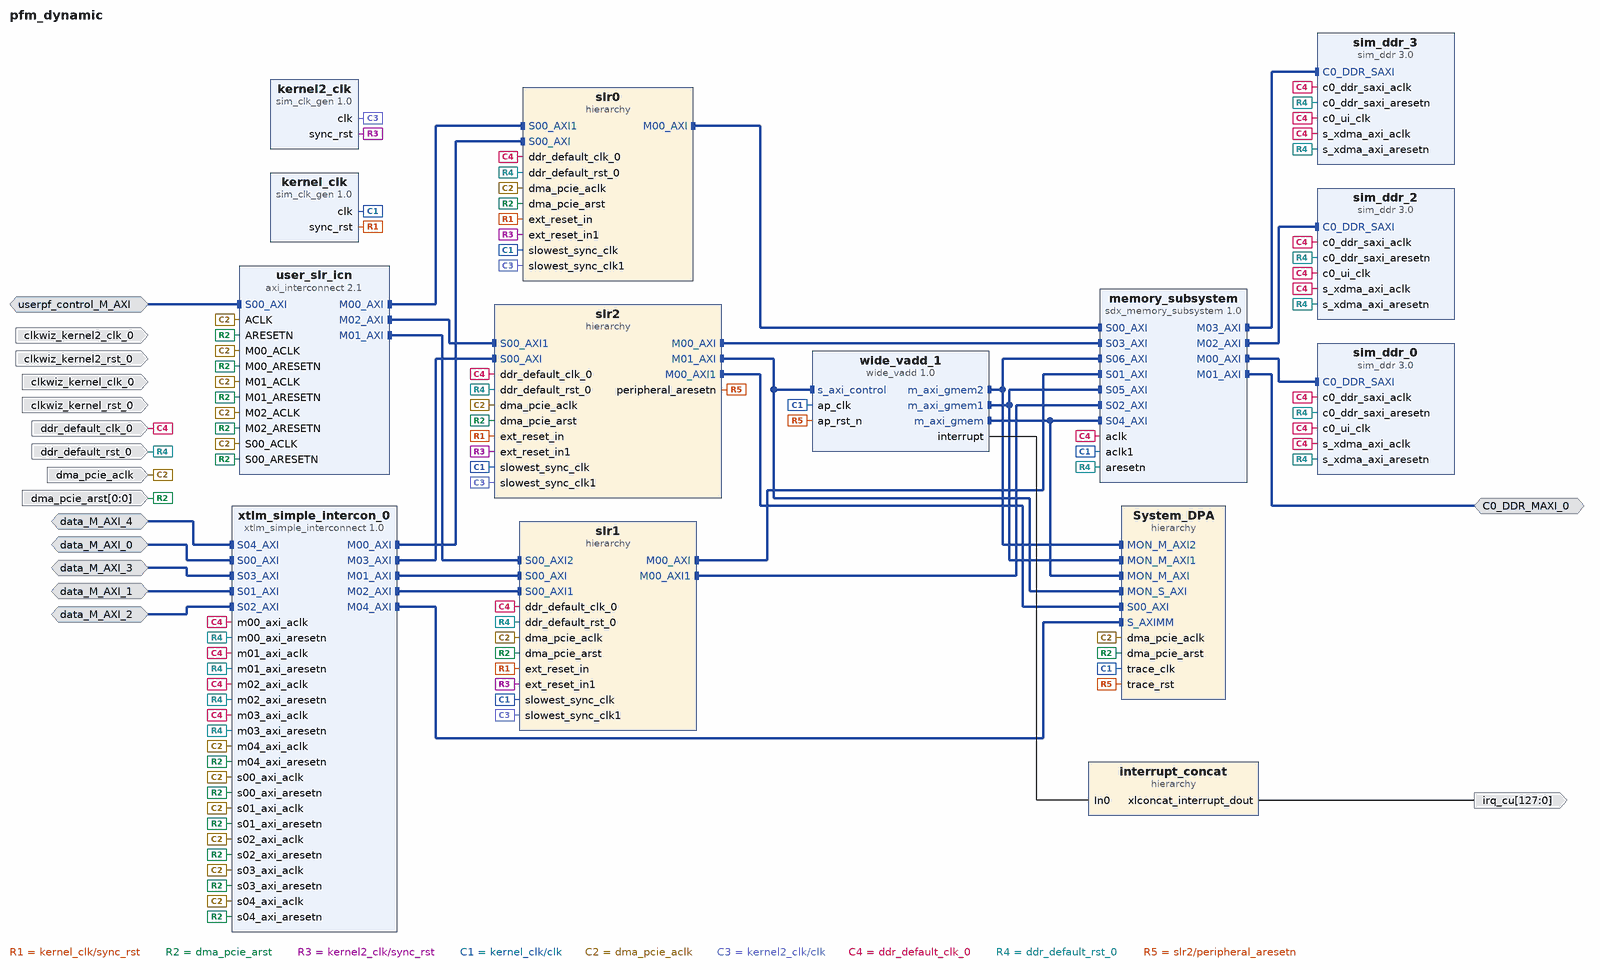
[diagram p0: block diagram of the top level]
# Vivado block design pfm_dynamic, xcvu9p-flgb2104-2-i, Vivado 2020.1
create_bd_design pfm_dynamic

create_bd_intf_port -mode Master -vlnv xilinx.com:interface:aximm_rtl:1.0 C0_DDR_MAXI_0
set_property -dict [list \
  CONFIG.DATA_WIDTH 512 \
  CONFIG.PROTOCOL AXI4 \
  CONFIG.FREQ_HZ 300120048 \
  CONFIG.ADDR_WIDTH 35 \
  CONFIG.HAS_BURST 1 \
  CONFIG.HAS_LOCK 0 \
  CONFIG.HAS_PROT 1 \
  CONFIG.HAS_CACHE 0 \
  CONFIG.HAS_QOS 0 \
  CONFIG.HAS_REGION 0 \
  CONFIG.HAS_WSTRB 1 \
  CONFIG.HAS_BRESP 1 \
  CONFIG.HAS_RRESP 1 \
] [get_bd_intf_ports C0_DDR_MAXI_0]
create_bd_intf_port -mode Slave -vlnv xilinx.com:interface:aximm_rtl:1.0 data_M_AXI_0
set_property -dict [list \
  CONFIG.DATA_WIDTH 32 \
  CONFIG.PROTOCOL AXI4 \
  CONFIG.FREQ_HZ 300000000 \
  CONFIG.ID_WIDTH 1 \
  CONFIG.ADDR_WIDTH 64 \
  CONFIG.AWUSER_WIDTH 0 \
  CONFIG.ARUSER_WIDTH 0 \
  CONFIG.WUSER_WIDTH 0 \
  CONFIG.RUSER_WIDTH 0 \
  CONFIG.BUSER_WIDTH 0 \
  CONFIG.READ_WRITE_MODE READ_WRITE \
  CONFIG.HAS_BURST 1 \
  CONFIG.HAS_LOCK 0 \
  CONFIG.HAS_PROT 1 \
  CONFIG.HAS_CACHE 0 \
  CONFIG.HAS_QOS 0 \
  CONFIG.HAS_REGION 0 \
  CONFIG.HAS_WSTRB 1 \
  CONFIG.HAS_BRESP 1 \
  CONFIG.HAS_RRESP 1 \
  CONFIG.SUPPORTS_NARROW_BURST 1 \
  CONFIG.NUM_READ_OUTSTANDING 2 \
  CONFIG.NUM_WRITE_OUTSTANDING 2 \
  CONFIG.MAX_BURST_LENGTH 1 \
  CONFIG.NUM_READ_THREADS 1 \
  CONFIG.NUM_WRITE_THREADS 1 \
  CONFIG.RUSER_BITS_PER_BYTE 0 \
  CONFIG.WUSER_BITS_PER_BYTE 0 \
] [get_bd_intf_ports data_M_AXI_0]
create_bd_intf_port -mode Slave -vlnv xilinx.com:interface:aximm_rtl:1.0 data_M_AXI_1
set_property -dict [list \
  CONFIG.DATA_WIDTH 512 \
  CONFIG.PROTOCOL AXI4 \
  CONFIG.FREQ_HZ 300000000 \
  CONFIG.ID_WIDTH 1 \
  CONFIG.ADDR_WIDTH 64 \
  CONFIG.AWUSER_WIDTH 0 \
  CONFIG.ARUSER_WIDTH 0 \
  CONFIG.WUSER_WIDTH 0 \
  CONFIG.RUSER_WIDTH 0 \
  CONFIG.BUSER_WIDTH 0 \
  CONFIG.READ_WRITE_MODE READ_WRITE \
  CONFIG.HAS_BURST 1 \
  CONFIG.HAS_LOCK 0 \
  CONFIG.HAS_PROT 1 \
  CONFIG.HAS_CACHE 0 \
  CONFIG.HAS_QOS 0 \
  CONFIG.HAS_REGION 0 \
  CONFIG.HAS_WSTRB 1 \
  CONFIG.HAS_BRESP 1 \
  CONFIG.HAS_RRESP 1 \
  CONFIG.SUPPORTS_NARROW_BURST 1 \
  CONFIG.NUM_READ_OUTSTANDING 2 \
  CONFIG.NUM_WRITE_OUTSTANDING 2 \
  CONFIG.MAX_BURST_LENGTH 1 \
  CONFIG.NUM_READ_THREADS 1 \
  CONFIG.NUM_WRITE_THREADS 1 \
  CONFIG.RUSER_BITS_PER_BYTE 0 \
  CONFIG.WUSER_BITS_PER_BYTE 0 \
] [get_bd_intf_ports data_M_AXI_1]
create_bd_intf_port -mode Slave -vlnv xilinx.com:interface:aximm_rtl:1.0 data_M_AXI_2
set_property -dict [list \
  CONFIG.DATA_WIDTH 512 \
  CONFIG.PROTOCOL AXI4 \
  CONFIG.FREQ_HZ 300000000 \
  CONFIG.ID_WIDTH 1 \
  CONFIG.ADDR_WIDTH 64 \
  CONFIG.AWUSER_WIDTH 0 \
  CONFIG.ARUSER_WIDTH 0 \
  CONFIG.WUSER_WIDTH 0 \
  CONFIG.RUSER_WIDTH 0 \
  CONFIG.BUSER_WIDTH 0 \
  CONFIG.READ_WRITE_MODE READ_WRITE \
  CONFIG.HAS_BURST 1 \
  CONFIG.HAS_LOCK 0 \
  CONFIG.HAS_PROT 1 \
  CONFIG.HAS_CACHE 0 \
  CONFIG.HAS_QOS 0 \
  CONFIG.HAS_REGION 0 \
  CONFIG.HAS_WSTRB 1 \
  CONFIG.HAS_BRESP 1 \
  CONFIG.HAS_RRESP 1 \
  CONFIG.SUPPORTS_NARROW_BURST 1 \
  CONFIG.NUM_READ_OUTSTANDING 2 \
  CONFIG.NUM_WRITE_OUTSTANDING 2 \
  CONFIG.MAX_BURST_LENGTH 1 \
  CONFIG.NUM_READ_THREADS 1 \
  CONFIG.NUM_WRITE_THREADS 1 \
  CONFIG.RUSER_BITS_PER_BYTE 0 \
  CONFIG.WUSER_BITS_PER_BYTE 0 \
] [get_bd_intf_ports data_M_AXI_2]
create_bd_intf_port -mode Slave -vlnv xilinx.com:interface:aximm_rtl:1.0 data_M_AXI_3
set_property -dict [list \
  CONFIG.DATA_WIDTH 512 \
  CONFIG.PROTOCOL AXI4 \
  CONFIG.FREQ_HZ 300000000 \
  CONFIG.ID_WIDTH 1 \
  CONFIG.ADDR_WIDTH 64 \
  CONFIG.AWUSER_WIDTH 0 \
  CONFIG.ARUSER_WIDTH 0 \
  CONFIG.WUSER_WIDTH 0 \
  CONFIG.RUSER_WIDTH 0 \
  CONFIG.BUSER_WIDTH 0 \
  CONFIG.READ_WRITE_MODE READ_WRITE \
  CONFIG.HAS_BURST 1 \
  CONFIG.HAS_LOCK 0 \
  CONFIG.HAS_PROT 1 \
  CONFIG.HAS_CACHE 0 \
  CONFIG.HAS_QOS 0 \
  CONFIG.HAS_REGION 0 \
  CONFIG.HAS_WSTRB 1 \
  CONFIG.HAS_BRESP 1 \
  CONFIG.HAS_RRESP 1 \
  CONFIG.SUPPORTS_NARROW_BURST 1 \
  CONFIG.NUM_READ_OUTSTANDING 2 \
  CONFIG.NUM_WRITE_OUTSTANDING 2 \
  CONFIG.MAX_BURST_LENGTH 1 \
  CONFIG.NUM_READ_THREADS 1 \
  CONFIG.NUM_WRITE_THREADS 1 \
  CONFIG.RUSER_BITS_PER_BYTE 0 \
  CONFIG.WUSER_BITS_PER_BYTE 0 \
] [get_bd_intf_ports data_M_AXI_3]
create_bd_intf_port -mode Slave -vlnv xilinx.com:interface:aximm_rtl:1.0 data_M_AXI_4
set_property -dict [list \
  CONFIG.DATA_WIDTH 512 \
  CONFIG.PROTOCOL AXI4 \
  CONFIG.FREQ_HZ 300000000 \
  CONFIG.ID_WIDTH 1 \
  CONFIG.ADDR_WIDTH 64 \
  CONFIG.AWUSER_WIDTH 0 \
  CONFIG.ARUSER_WIDTH 0 \
  CONFIG.WUSER_WIDTH 0 \
  CONFIG.RUSER_WIDTH 0 \
  CONFIG.BUSER_WIDTH 0 \
  CONFIG.READ_WRITE_MODE READ_WRITE \
  CONFIG.HAS_BURST 1 \
  CONFIG.HAS_LOCK 0 \
  CONFIG.HAS_PROT 1 \
  CONFIG.HAS_CACHE 0 \
  CONFIG.HAS_QOS 0 \
  CONFIG.HAS_REGION 0 \
  CONFIG.HAS_WSTRB 1 \
  CONFIG.HAS_BRESP 1 \
  CONFIG.HAS_RRESP 1 \
  CONFIG.SUPPORTS_NARROW_BURST 1 \
  CONFIG.NUM_READ_OUTSTANDING 2 \
  CONFIG.NUM_WRITE_OUTSTANDING 2 \
  CONFIG.MAX_BURST_LENGTH 1 \
  CONFIG.NUM_READ_THREADS 1 \
  CONFIG.NUM_WRITE_THREADS 1 \
  CONFIG.RUSER_BITS_PER_BYTE 0 \
  CONFIG.WUSER_BITS_PER_BYTE 0 \
] [get_bd_intf_ports data_M_AXI_4]
create_bd_intf_port -mode Slave -vlnv xilinx.com:interface:aximm_rtl:1.0 userpf_control_M_AXI
set_property -dict [list \
  CONFIG.DATA_WIDTH 32 \
  CONFIG.PROTOCOL AXI4LITE \
  CONFIG.FREQ_HZ 300000000 \
  CONFIG.ID_WIDTH 0 \
  CONFIG.ADDR_WIDTH 29 \
  CONFIG.AWUSER_WIDTH 0 \
  CONFIG.ARUSER_WIDTH 0 \
  CONFIG.WUSER_WIDTH 0 \
  CONFIG.RUSER_WIDTH 0 \
  CONFIG.BUSER_WIDTH 0 \
  CONFIG.READ_WRITE_MODE READ_WRITE \
  CONFIG.HAS_BURST 0 \
  CONFIG.HAS_LOCK 0 \
  CONFIG.HAS_PROT 1 \
  CONFIG.HAS_CACHE 0 \
  CONFIG.HAS_QOS 0 \
  CONFIG.HAS_REGION 0 \
  CONFIG.HAS_WSTRB 1 \
  CONFIG.HAS_BRESP 1 \
  CONFIG.HAS_RRESP 1 \
  CONFIG.SUPPORTS_NARROW_BURST 0 \
  CONFIG.NUM_READ_OUTSTANDING 2 \
  CONFIG.NUM_WRITE_OUTSTANDING 2 \
  CONFIG.MAX_BURST_LENGTH 1 \
  CONFIG.NUM_READ_THREADS 1 \
  CONFIG.NUM_WRITE_THREADS 1 \
  CONFIG.RUSER_BITS_PER_BYTE 0 \
  CONFIG.WUSER_BITS_PER_BYTE 0 \
] [get_bd_intf_ports userpf_control_M_AXI]
create_bd_port -dir I -type clk clkwiz_kernel2_clk_0
set_property -dict {CONFIG.FREQ_HZ 500000000} [get_bd_ports clkwiz_kernel2_clk_0]
create_bd_port -dir I -type clk clkwiz_kernel_clk_0
set_property -dict {CONFIG.FREQ_HZ 300000000} [get_bd_ports clkwiz_kernel_clk_0]
create_bd_port -dir I -type rst clkwiz_kernel2_rst_0
create_bd_port -dir I -type rst clkwiz_kernel_rst_0
create_bd_port -dir I -type clk dma_pcie_aclk
set_property -dict [list \
  CONFIG.ASSOCIATED_BUSIF userpf_control_M_AXI:userpf_control_M_AXI_slr1:userpf_control_M_AXI_slr2:data_M_AXI_0:data_M_AXI_1:data_M_AXI_2:data_M_AXI_3:data_M_AXI_4 \
  CONFIG.FREQ_HZ 300000000 \
] [get_bd_ports dma_pcie_aclk]
create_bd_port -dir O -from 127 -to 0 -type intr irq_cu
create_bd_port -dir I -from 0 -to 0 -type rst dma_pcie_arst
create_bd_port -dir I -type clk ddr_default_clk_0
set_property -dict {CONFIG.ASSOCIATED_BUSIF C0_DDR_MAXI_0 CONFIG.FREQ_HZ 300120048} [get_bd_ports ddr_default_clk_0]
create_bd_port -dir I -type rst ddr_default_rst_0

create_bd_cell -type ip -vlnv xilinx.com:ip:sim_clk_gen:1.0 kernel2_clk
set_property -dict {CONFIG.FREQ_HZ 500000000} [get_bd_cells kernel2_clk]
create_bd_cell -type ip -vlnv xilinx.com:ip:sim_clk_gen:1.0 kernel_clk
set_property -dict {CONFIG.FREQ_HZ 300000000} [get_bd_cells kernel_clk]
create_bd_cell -type ip -vlnv xilinx.com:ip:xtlm_simple_interconnect:1.0 xtlm_simple_intercon_0
set_property -dict [list \
  CONFIG.C_ADDR_RANGES 2 \
  CONFIG.C_M00_A00_ADDR_RANGE {"0000000000000000000000000000001111111111111111111111111111111111"} \
  CONFIG.C_M00_A00_BASE_ADDRESS 0x0000004000000000 \
  CONFIG.C_M00_A01_ADDR_RANGE 0x0000000000060000 \
  CONFIG.C_M00_A01_BASE_ADDRESS {"0000000000000000000000000101000000000000000000000000000000000000"} \
  CONFIG.C_M00_AXI_ADDR_WIDTH 64 \
  CONFIG.C_M00_AXI_DATA_WIDTH 32 \
  CONFIG.C_M01_A00_ADDR_RANGE {"0000000000000000000000000000001111111111111111111111111111111111"} \
  CONFIG.C_M01_A00_BASE_ADDRESS 0x0000000400000000 \
  CONFIG.C_M01_A01_ADDR_RANGE 0x0000000000060000 \
  CONFIG.C_M01_A01_BASE_ADDRESS {"0000000000000000000000000101000000000000000000000000000000000000"} \
  CONFIG.C_M01_AXI_ADDR_WIDTH 64 \
  CONFIG.C_M01_AXI_DATA_WIDTH 32 \
  CONFIG.C_M02_A00_ADDR_RANGE {"0000000000000000000000000000001111111111111111111111111111111111"} \
  CONFIG.C_M02_A00_BASE_ADDRESS 0x0000004800000000 \
  CONFIG.C_M02_A01_ADDR_RANGE 0x0000000000060000 \
  CONFIG.C_M02_A01_BASE_ADDRESS {"0000000000000000000000000101000000000000000000000000000000000000"} \
  CONFIG.C_M02_AXI_ADDR_WIDTH 64 \
  CONFIG.C_M02_AXI_DATA_WIDTH 32 \
  CONFIG.C_M03_A00_ADDR_RANGE {"0000000000000000000000000000001111111111111111111111111111111111"} \
  CONFIG.C_M03_A00_BASE_ADDRESS 0x0000004C00000000 \
  CONFIG.C_M03_A01_ADDR_RANGE 0x0000000000060000 \
  CONFIG.C_M03_A01_BASE_ADDRESS {"0000000000000000000000000101000000000000000000000000000000000000"} \
  CONFIG.C_M03_AXI_ADDR_WIDTH 64 \
  CONFIG.C_M03_AXI_DATA_WIDTH 32 \
  CONFIG.C_M04_A00_ADDR_RANGE 0x0000000200000000 \
  CONFIG.C_M04_A00_BASE_ADDRESS 0x0000000000000000 \
  CONFIG.C_M04_AXI_DATA_WIDTH 64 \
  CONFIG.C_NUM_MI 5 \
  CONFIG.C_NUM_SI 5 \
  CONFIG.C_S00_AXI_ADDR_WIDTH 64 \
  CONFIG.C_S00_AXI_DATA_WIDTH 32 \
  CONFIG.C_S01_AXI_ADDR_WIDTH 64 \
  CONFIG.C_S01_AXI_DATA_WIDTH 512 \
  CONFIG.C_S02_AXI_ADDR_WIDTH 64 \
  CONFIG.C_S02_AXI_DATA_WIDTH 512 \
  CONFIG.C_S03_AXI_ADDR_WIDTH 64 \
  CONFIG.C_S03_AXI_DATA_WIDTH 512 \
  CONFIG.C_S04_AXI_ADDR_WIDTH 64 \
  CONFIG.C_S04_AXI_DATA_WIDTH 512 \
] [get_bd_cells xtlm_simple_intercon_0]
create_bd_cell -type hier interrupt_concat
create_bd_cell -type ip -vlnv xilinx.com:ip:sdx_memory_subsystem:1.0 memory_subsystem
set_property -dict [list \
  CONFIG.ADVANCED_PROPERTIES {resource_map_replication {S00_AXI {} S01_AXI {} S02_AXI {} S03_AXI {}} plram_specifications {{ SIZE 128K AXI_DATA_WIDTH 512 SLR_ASSIGNMENT SLR2 } { SIZE 128K AXI_DATA_WIDTH 512 SLR_ASSIGNMENT SLR1 } { SIZE 128K AXI_DATA_WIDTH 512 SLR_ASSIGNMENT SLR0 }} resource_access_constraints {S00_AXI {M00_AXI_MEM00 PLRAM_MEM00 PLRAM_MEM01 PLRAM_MEM02} S01_AXI M01_AXI_MEM00 S02_AXI M02_AXI_MEM00 S03_AXI M03_AXI_MEM00} __temp_dsa_info {excluded_board_components {amazon:minotaur-vu9p-f1:ddr4_sdram_c0:1.0 amazon:minotaur-vu9p-f1:ddr4_sdram_c1:1.0 amazon:minotaur-vu9p-f1:ddr4_sdram_c2:1.0 amazon:minotaur-vu9p-f1:ddr4_sdram_c3:1.0} axi_passthrough {amazon:minotaur-vu9p-f1:ddr4_sdram_c0:1.0 {offset 0x4000000000 range 16G slr SLR0} amazon:minotaur-vu9p-f1:ddr4_sdram_c1:1.0 {offset 0x400000000 range 16G slr SLR1} amazon:minotaur-vu9p-f1:ddr4_sdram_c2:1.0 {offset 0x4800000000 range 16G slr SLR1} amazon:minotaur-vu9p-f1:ddr4_sdram_c3:1.0 {offset 0x4c00000000 range 16G slr SLR2}} sim_props {ddr4_0 {offset 0x4000000000 range 0x400000000 slr SLR0 passthrough yes} ddr4_1 {offset 0x400000000 range 0x400000000 slr SLR1 passthrough yes} ddr4_2 {offset 0x4800000000 range 0x400000000 slr SLR1 passthrough yes} ddr4_3 {offset 0x4c00000000 range 0x400000000 slr SLR2 passthrough yes} plram_0 {offset 0x5000000000 range 0x20000 slr SLR0 passthrough no} plram_1 {offset 0x5000020000 range 0x20000 slr SLR1 passthrough no} plram_2 {offset 0x5000040000 range 0x20000 slr SLR2 passthrough no}} slr_pblock_map {SLR0 block_dynamic_SLR0 SLR1 pblock_dynamic_SLR1 SLR2 pblock_dynamic_SLR2} child_pblock_declarations {pblock_ddr4_mem00 {range CLOCKREGION_X2Y1:CLOCKREGION_X2Y3 parent pblock_dynamic_SLR0 cell_paths memory/ddr4_mem00} pblock_ddr4_mem02 {range CLOCKREGION_X2Y7:CLOCKREGION_X2Y9 parent pblock_dynamic_SLR1 cell_paths memory/ddr4_mem02} pblock_ddr4_mem03 {range CLOCKREGION_X4Y11:CLOCKREGION_X4Y13 parent pblock_dynamic_SLR2 cell_paths memory/ddr4_mem03}} board_component_slr_map {aws_ddra SLR2 aws_ddrb SLR1 aws_ddrc SLR1 aws_ddrd SLR0}}} \
  CONFIG.NUM_CLKS 2 \
  CONFIG.NUM_SI 7 \
] [get_bd_cells memory_subsystem]
create_bd_cell -type ip -vlnv xilinx.com:user:sim_ddr:3.0 sim_ddr_0
set_property -dict [list \
  CONFIG.C0_A00_BASE_ADDR 0x0 \
  CONFIG.C0_A00_HIGH_ADDR 0x0000000400000000 \
  CONFIG.C0_APP_ADDR_WIDTH 31 \
  CONFIG.C0_APP_DATA_WIDTH 512 \
  CONFIG.C0_BANK_GROUP_WIDTH 2 \
  CONFIG.C0_BANK_WIDTH 2 \
  CONFIG.C0_COLUMN_WIDTH 10 \
  CONFIG.C0_DATA_WIDTH 72 \
  CONFIG.C0_DDR_SAXI_ADDR_WIDTH 34 \
  CONFIG.C0_DDR_SAXI_BASEADDR 0x0000000000000000 \
  CONFIG.C0_DDR_SAXI_DATA_WIDTH 512 \
  CONFIG.C0_DDR_SAXI_HIGHADDR 0x0000000400000000 \
  CONFIG.C0_MEMORY_PART MTA18ASF2G72PZ-2G3 \
  CONFIG.C0_MEM_ADDR_MAP ROW_COLUMN_BANK \
  CONFIG.C0_Mem_Add_Map ROW_COLUMN_BANK \
  CONFIG.C0_RANK_WIDTH 1 \
  CONFIG.C0_ROW_WIDTH 17 \
  CONFIG.C0_SIZE 16GB \
  CONFIG.C0_TIMEPERIOD_PS 833 \
  CONFIG.C0_TYPE ddr4 \
  CONFIG.C0_tCK 833 \
  CONFIG.C0_tCKE 0 \
  CONFIG.C0_tFAW 16 \
  CONFIG.C0_tMRD 2 \
  CONFIG.C0_tRAS 39 \
  CONFIG.C0_tRCD 17 \
  CONFIG.C0_tREFI 9363 \
  CONFIG.C0_tRFC 421 \
  CONFIG.C0_tRP 17 \
  CONFIG.C0_tRRD_L 6 \
  CONFIG.C0_tRRD_S 4 \
  CONFIG.C0_tRTP 10 \
  CONFIG.C0_tWR 19 \
  CONFIG.C0_tWTR_L 10 \
  CONFIG.C0_tWTR_S 4 \
  CONFIG.C_NUMBER_OF_GLOBAL_MEMORIES 1 \
] [get_bd_cells sim_ddr_0]
create_bd_cell -type ip -vlnv xilinx.com:user:sim_ddr:3.0 sim_ddr_2
set_property -dict [list \
  CONFIG.C0_A00_BASE_ADDR 0x0 \
  CONFIG.C0_A00_HIGH_ADDR 0x0000000400000000 \
  CONFIG.C0_APP_ADDR_WIDTH 31 \
  CONFIG.C0_APP_DATA_WIDTH 512 \
  CONFIG.C0_BANK_GROUP_WIDTH 2 \
  CONFIG.C0_BANK_WIDTH 2 \
  CONFIG.C0_COLUMN_WIDTH 10 \
  CONFIG.C0_DATA_WIDTH 72 \
  CONFIG.C0_DDR_SAXI_ADDR_WIDTH 34 \
  CONFIG.C0_DDR_SAXI_BASEADDR 0x0000000000000000 \
  CONFIG.C0_DDR_SAXI_DATA_WIDTH 512 \
  CONFIG.C0_DDR_SAXI_HIGHADDR 0x0000000400000000 \
  CONFIG.C0_MEMORY_PART MTA18ASF2G72PZ-2G3 \
  CONFIG.C0_MEM_ADDR_MAP ROW_COLUMN_BANK \
  CONFIG.C0_Mem_Add_Map ROW_COLUMN_BANK \
  CONFIG.C0_RANK_WIDTH 1 \
  CONFIG.C0_ROW_WIDTH 17 \
  CONFIG.C0_SIZE 16GB \
  CONFIG.C0_TIMEPERIOD_PS 833 \
  CONFIG.C0_TYPE ddr4 \
  CONFIG.C0_tCK 833 \
  CONFIG.C0_tCKE 0 \
  CONFIG.C0_tFAW 16 \
  CONFIG.C0_tMRD 2 \
  CONFIG.C0_tRAS 39 \
  CONFIG.C0_tRCD 17 \
  CONFIG.C0_tREFI 9363 \
  CONFIG.C0_tRFC 421 \
  CONFIG.C0_tRP 17 \
  CONFIG.C0_tRRD_L 6 \
  CONFIG.C0_tRRD_S 4 \
  CONFIG.C0_tRTP 10 \
  CONFIG.C0_tWR 19 \
  CONFIG.C0_tWTR_L 10 \
  CONFIG.C0_tWTR_S 4 \
  CONFIG.C_NUMBER_OF_GLOBAL_MEMORIES 1 \
] [get_bd_cells sim_ddr_2]
create_bd_cell -type ip -vlnv xilinx.com:user:sim_ddr:3.0 sim_ddr_3
set_property -dict [list \
  CONFIG.C0_A00_BASE_ADDR 0x0 \
  CONFIG.C0_A00_HIGH_ADDR 0x0000000400000000 \
  CONFIG.C0_APP_ADDR_WIDTH 31 \
  CONFIG.C0_APP_DATA_WIDTH 512 \
  CONFIG.C0_BANK_GROUP_WIDTH 2 \
  CONFIG.C0_BANK_WIDTH 2 \
  CONFIG.C0_COLUMN_WIDTH 10 \
  CONFIG.C0_DATA_WIDTH 72 \
  CONFIG.C0_DDR_SAXI_ADDR_WIDTH 34 \
  CONFIG.C0_DDR_SAXI_BASEADDR 0x0000000000000000 \
  CONFIG.C0_DDR_SAXI_DATA_WIDTH 512 \
  CONFIG.C0_DDR_SAXI_HIGHADDR 0x0000000400000000 \
  CONFIG.C0_MEMORY_PART MTA18ASF2G72PZ-2G3 \
  CONFIG.C0_MEM_ADDR_MAP ROW_COLUMN_BANK \
  CONFIG.C0_Mem_Add_Map ROW_COLUMN_BANK \
  CONFIG.C0_RANK_WIDTH 1 \
  CONFIG.C0_ROW_WIDTH 17 \
  CONFIG.C0_SIZE 16GB \
  CONFIG.C0_TIMEPERIOD_PS 833 \
  CONFIG.C0_TYPE ddr4 \
  CONFIG.C0_tCK 833 \
  CONFIG.C0_tCKE 0 \
  CONFIG.C0_tFAW 16 \
  CONFIG.C0_tMRD 2 \
  CONFIG.C0_tRAS 39 \
  CONFIG.C0_tRCD 17 \
  CONFIG.C0_tREFI 9363 \
  CONFIG.C0_tRFC 421 \
  CONFIG.C0_tRP 17 \
  CONFIG.C0_tRRD_L 6 \
  CONFIG.C0_tRRD_S 4 \
  CONFIG.C0_tRTP 10 \
  CONFIG.C0_tWR 19 \
  CONFIG.C0_tWTR_L 10 \
  CONFIG.C0_tWTR_S 4 \
  CONFIG.C_NUMBER_OF_GLOBAL_MEMORIES 1 \
] [get_bd_cells sim_ddr_3]
create_bd_cell -type hier slr0
create_bd_cell -type hier slr1
create_bd_cell -type hier slr2
create_bd_cell -type ip -vlnv xilinx.com:hls:wide_vadd:1.0 wide_vadd_1
set_property -dict {CONFIG.SLR_ASSIGNMENTS SLR2} [get_bd_cells wide_vadd_1]
create_bd_cell -type hier System_DPA
create_bd_cell -type ip -vlnv xilinx.com:ip:axi_interconnect:2.1 user_slr_icn
set_property -dict {CONFIG.NUM_MI 3 CONFIG.NUM_SI 1} [get_bd_cells user_slr_icn]

# ---- hierarchy /interrupt_concat ----
current_bd_instance /interrupt_concat
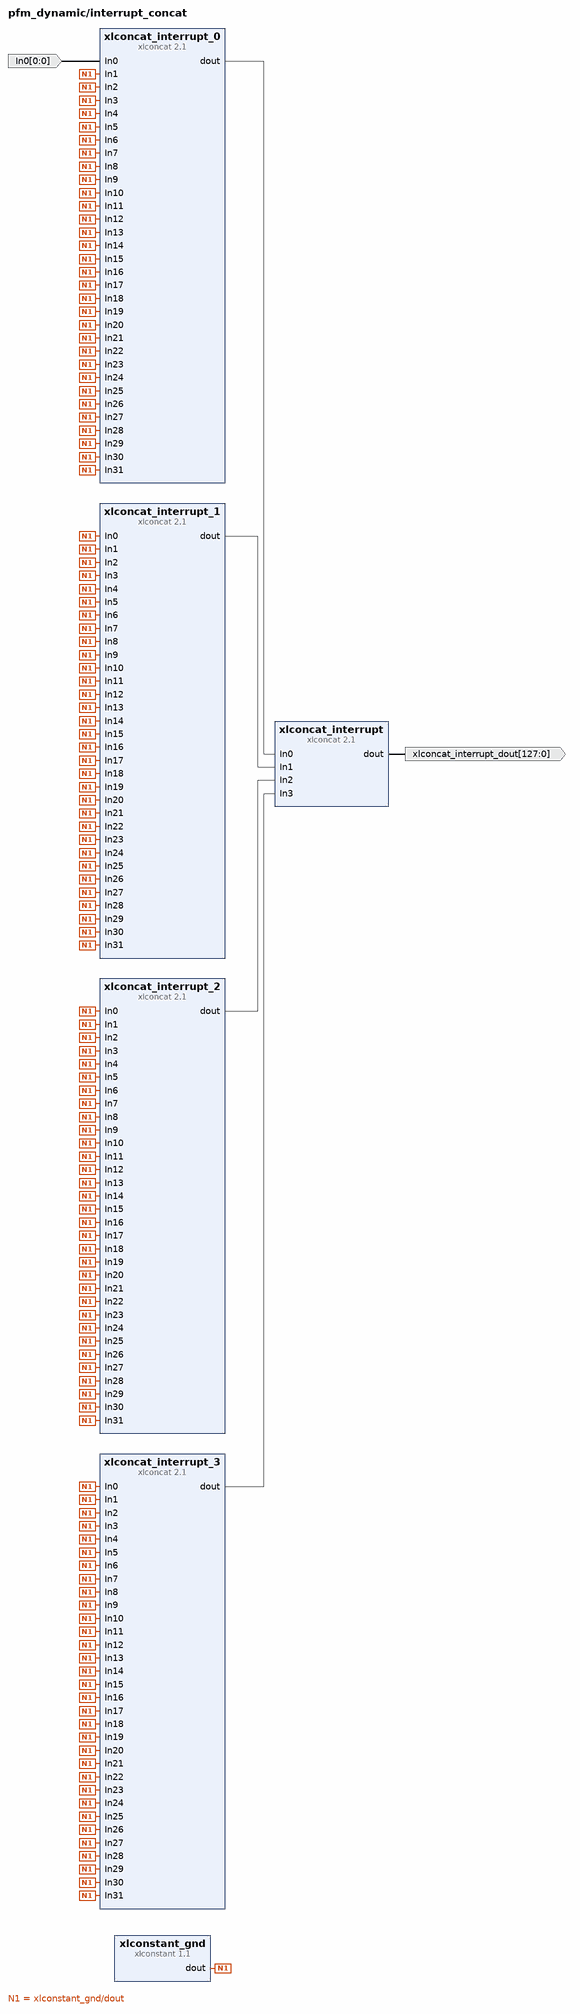
[diagram p1: block diagram inside /interrupt_concat]
create_bd_pin -dir I -from 0 -to 0 In0
create_bd_pin -dir O -from 127 -to 0 xlconcat_interrupt_dout

create_bd_cell -type ip -vlnv xilinx.com:ip:xlconcat:2.1 xlconcat_interrupt
set_property -dict {CONFIG.NUM_PORTS 4} [get_bd_cells xlconcat_interrupt]
create_bd_cell -type ip -vlnv xilinx.com:ip:xlconcat:2.1 xlconcat_interrupt_0
set_property -dict {CONFIG.NUM_PORTS 32} [get_bd_cells xlconcat_interrupt_0]
create_bd_cell -type ip -vlnv xilinx.com:ip:xlconcat:2.1 xlconcat_interrupt_1
set_property -dict {CONFIG.NUM_PORTS 32} [get_bd_cells xlconcat_interrupt_1]
create_bd_cell -type ip -vlnv xilinx.com:ip:xlconcat:2.1 xlconcat_interrupt_2
set_property -dict {CONFIG.NUM_PORTS 32} [get_bd_cells xlconcat_interrupt_2]
create_bd_cell -type ip -vlnv xilinx.com:ip:xlconcat:2.1 xlconcat_interrupt_3
set_property -dict {CONFIG.NUM_PORTS 32} [get_bd_cells xlconcat_interrupt_3]
create_bd_cell -type ip -vlnv xilinx.com:ip:xlconstant:1.1 xlconstant_gnd
set_property -dict {CONFIG.CONST_VAL 0} [get_bd_cells xlconstant_gnd]

# ---- hierarchy /slr0 ----
current_bd_instance /slr0
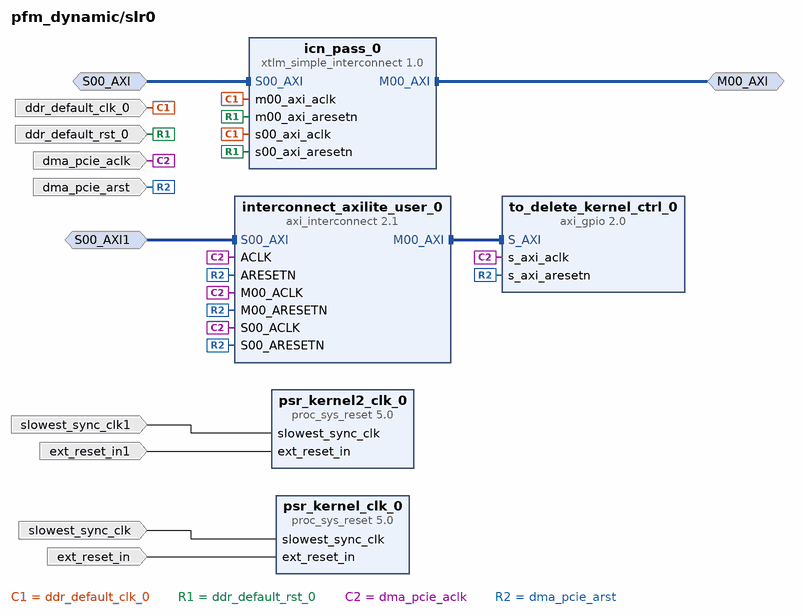
[diagram p2: block diagram inside /slr0]
create_bd_intf_pin -mode Slave -vlnv xilinx.com:interface:aximm_rtl:1.0 S00_AXI
create_bd_intf_pin -mode Master -vlnv xilinx.com:interface:aximm_rtl:1.0 M00_AXI
create_bd_intf_pin -mode Slave -vlnv xilinx.com:interface:aximm_rtl:1.0 S00_AXI1
create_bd_pin -dir I -type clk ddr_default_clk_0
create_bd_pin -dir I -type rst ddr_default_rst_0
create_bd_pin -dir I -type clk slowest_sync_clk
create_bd_pin -dir I -type rst ext_reset_in
create_bd_pin -dir I -type clk slowest_sync_clk1
create_bd_pin -dir I -type rst ext_reset_in1
create_bd_pin -dir I -type clk dma_pcie_aclk
create_bd_pin -dir I -type rst dma_pcie_arst

create_bd_cell -type ip -vlnv xilinx.com:ip:xtlm_simple_interconnect:1.0 icn_pass_0
set_property -dict [list \
  CONFIG.C_M00_AXI_ADDR_WIDTH 64 \
  CONFIG.C_NUM_MI 1 \
  CONFIG.C_NUM_SI 1 \
  CONFIG.SLR_ASSIGNMENTS SLR0 \
] [get_bd_cells icn_pass_0]
create_bd_cell -type ip -vlnv xilinx.com:ip:proc_sys_reset:5.0 psr_kernel_clk_0
set_property -dict {CONFIG.SLR_ASSIGNMENTS SLR0} [get_bd_cells psr_kernel_clk_0]
create_bd_cell -type ip -vlnv xilinx.com:ip:proc_sys_reset:5.0 psr_kernel2_clk_0
set_property -dict {CONFIG.SLR_ASSIGNMENTS SLR0} [get_bd_cells psr_kernel2_clk_0]
create_bd_cell -type ip -vlnv xilinx.com:ip:axi_gpio:2.0 to_delete_kernel_ctrl_0
create_bd_cell -type ip -vlnv xilinx.com:ip:axi_interconnect:2.1 interconnect_axilite_user_0
set_property -dict [list \
  CONFIG.M01_HAS_REGSLICE 1 \
  CONFIG.NUM_MI 1 \
  CONFIG.NUM_SI 1 \
  CONFIG.SLR_ASSIGNMENTS SLR0 \
] [get_bd_cells interconnect_axilite_user_0]

# ---- hierarchy /slr1 ----
current_bd_instance /slr1
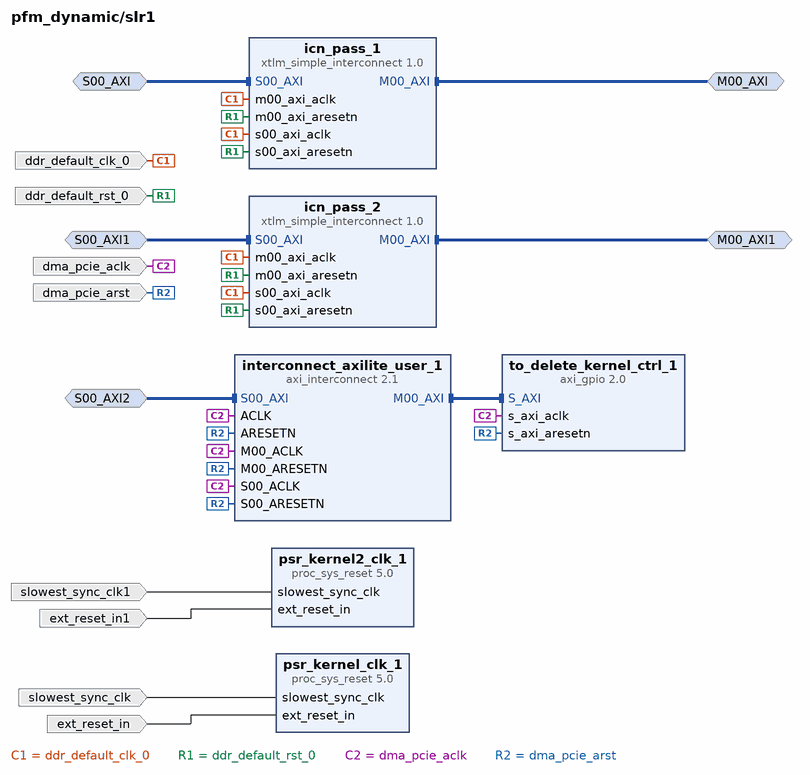
[diagram p3: block diagram inside /slr1]
create_bd_intf_pin -mode Slave -vlnv xilinx.com:interface:aximm_rtl:1.0 S00_AXI
create_bd_intf_pin -mode Master -vlnv xilinx.com:interface:aximm_rtl:1.0 M00_AXI
create_bd_intf_pin -mode Slave -vlnv xilinx.com:interface:aximm_rtl:1.0 S00_AXI1
create_bd_intf_pin -mode Master -vlnv xilinx.com:interface:aximm_rtl:1.0 M00_AXI1
create_bd_intf_pin -mode Slave -vlnv xilinx.com:interface:aximm_rtl:1.0 S00_AXI2
create_bd_pin -dir I -type clk ddr_default_clk_0
create_bd_pin -dir I -type rst ddr_default_rst_0
create_bd_pin -dir I -type clk slowest_sync_clk
create_bd_pin -dir I -type rst ext_reset_in
create_bd_pin -dir I -type clk slowest_sync_clk1
create_bd_pin -dir I -type rst ext_reset_in1
create_bd_pin -dir I -type clk dma_pcie_aclk
create_bd_pin -dir I -type rst dma_pcie_arst

create_bd_cell -type ip -vlnv xilinx.com:ip:xtlm_simple_interconnect:1.0 icn_pass_1
set_property -dict [list \
  CONFIG.C_M00_AXI_ADDR_WIDTH 64 \
  CONFIG.C_NUM_MI 1 \
  CONFIG.C_NUM_SI 1 \
  CONFIG.SLR_ASSIGNMENTS SLR1 \
] [get_bd_cells icn_pass_1]
create_bd_cell -type ip -vlnv xilinx.com:ip:xtlm_simple_interconnect:1.0 icn_pass_2
set_property -dict [list \
  CONFIG.C_M00_AXI_ADDR_WIDTH 64 \
  CONFIG.C_NUM_MI 1 \
  CONFIG.C_NUM_SI 1 \
  CONFIG.SLR_ASSIGNMENTS SLR1 \
] [get_bd_cells icn_pass_2]
create_bd_cell -type ip -vlnv xilinx.com:ip:proc_sys_reset:5.0 psr_kernel_clk_1
set_property -dict {CONFIG.SLR_ASSIGNMENTS SLR1} [get_bd_cells psr_kernel_clk_1]
create_bd_cell -type ip -vlnv xilinx.com:ip:proc_sys_reset:5.0 psr_kernel2_clk_1
set_property -dict {CONFIG.SLR_ASSIGNMENTS SLR1} [get_bd_cells psr_kernel2_clk_1]
create_bd_cell -type ip -vlnv xilinx.com:ip:axi_gpio:2.0 to_delete_kernel_ctrl_1
create_bd_cell -type ip -vlnv xilinx.com:ip:axi_interconnect:2.1 interconnect_axilite_user_1
set_property -dict [list \
  CONFIG.M01_HAS_REGSLICE 1 \
  CONFIG.NUM_MI 1 \
  CONFIG.NUM_SI 1 \
  CONFIG.SLR_ASSIGNMENTS SLR1 \
] [get_bd_cells interconnect_axilite_user_1]

# ---- hierarchy /slr2 ----
current_bd_instance /slr2
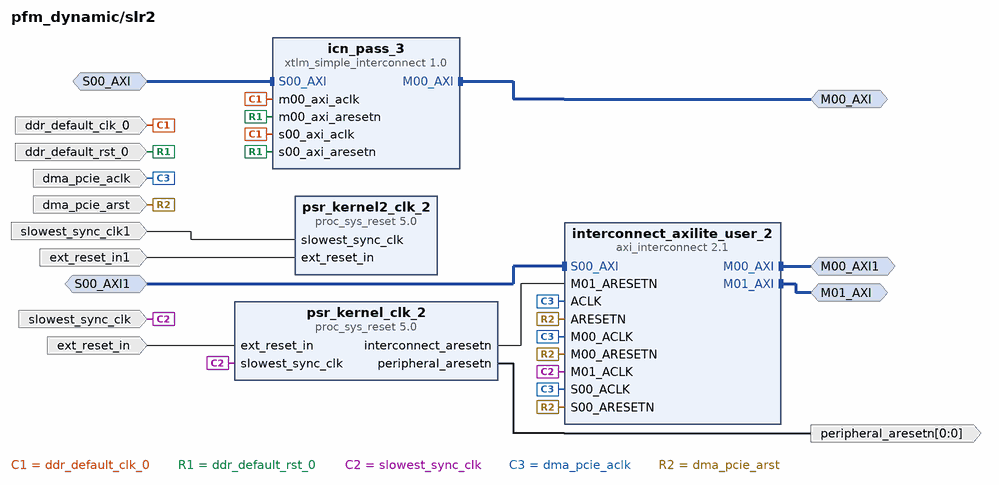
[diagram p4: block diagram inside /slr2]
create_bd_intf_pin -mode Slave -vlnv xilinx.com:interface:aximm_rtl:1.0 S00_AXI
create_bd_intf_pin -mode Master -vlnv xilinx.com:interface:aximm_rtl:1.0 M00_AXI
create_bd_intf_pin -mode Slave -vlnv xilinx.com:interface:aximm_rtl:1.0 S00_AXI1
create_bd_intf_pin -mode Master -vlnv xilinx.com:interface:aximm_rtl:1.0 M01_AXI
create_bd_intf_pin -mode Master -vlnv xilinx.com:interface:aximm_rtl:1.0 M00_AXI1
create_bd_pin -dir I -type clk ddr_default_clk_0
create_bd_pin -dir I -type rst ddr_default_rst_0
create_bd_pin -dir I -type clk slowest_sync_clk
create_bd_pin -dir I -type rst ext_reset_in
create_bd_pin -dir I -type clk slowest_sync_clk1
create_bd_pin -dir I -type rst ext_reset_in1
create_bd_pin -dir I -type clk dma_pcie_aclk
create_bd_pin -dir I -type rst dma_pcie_arst
create_bd_pin -dir O -from 0 -to 0 -type rst peripheral_aresetn

create_bd_cell -type ip -vlnv xilinx.com:ip:xtlm_simple_interconnect:1.0 icn_pass_3
set_property -dict [list \
  CONFIG.C_M00_AXI_ADDR_WIDTH 64 \
  CONFIG.C_NUM_MI 1 \
  CONFIG.C_NUM_SI 1 \
  CONFIG.SLR_ASSIGNMENTS SLR2 \
] [get_bd_cells icn_pass_3]
create_bd_cell -type ip -vlnv xilinx.com:ip:proc_sys_reset:5.0 psr_kernel_clk_2
set_property -dict {CONFIG.SLR_ASSIGNMENTS SLR2} [get_bd_cells psr_kernel_clk_2]
create_bd_cell -type ip -vlnv xilinx.com:ip:proc_sys_reset:5.0 psr_kernel2_clk_2
set_property -dict {CONFIG.SLR_ASSIGNMENTS SLR2} [get_bd_cells psr_kernel2_clk_2]
create_bd_cell -type ip -vlnv xilinx.com:ip:axi_interconnect:2.1 interconnect_axilite_user_2
set_property -dict [list \
  CONFIG.M01_HAS_REGSLICE 1 \
  CONFIG.NUM_MI 2 \
  CONFIG.NUM_SI 1 \
  CONFIG.SLR_ASSIGNMENTS SLR2 \
] [get_bd_cells interconnect_axilite_user_2]

# ---- hierarchy /System_DPA ----
current_bd_instance /System_DPA
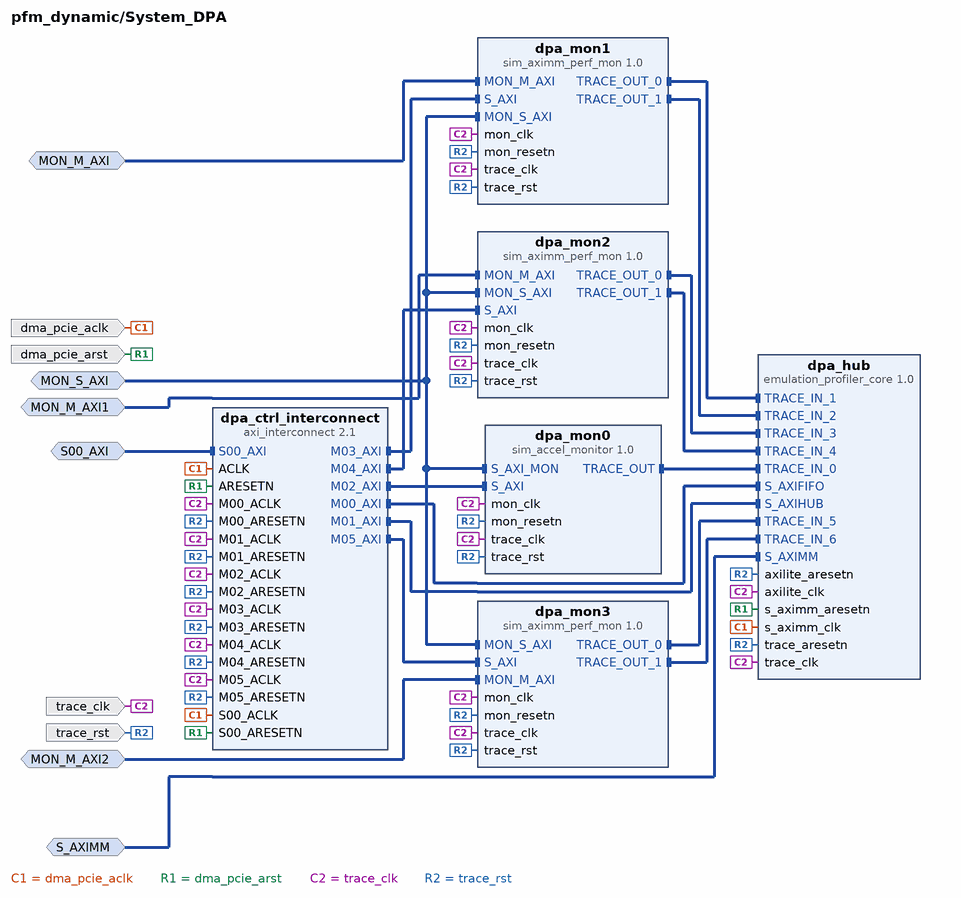
[diagram p5: block diagram inside /System_DPA]
create_bd_intf_pin -mode Slave -vlnv xilinx.com:interface:aximm_rtl:1.0 S00_AXI
create_bd_intf_pin -mode Slave -vlnv xilinx.com:interface:aximm_rtl:1.0 S_AXIMM
create_bd_intf_pin -mode Monitor -vlnv xilinx.com:interface:aximm_rtl:1.0 MON_S_AXI
create_bd_intf_pin -mode Monitor -vlnv xilinx.com:interface:aximm_rtl:1.0 MON_M_AXI
create_bd_intf_pin -mode Monitor -vlnv xilinx.com:interface:aximm_rtl:1.0 MON_M_AXI1
create_bd_intf_pin -mode Monitor -vlnv xilinx.com:interface:aximm_rtl:1.0 MON_M_AXI2
create_bd_pin -dir I -type clk dma_pcie_aclk
create_bd_pin -dir I -type rst dma_pcie_arst
create_bd_pin -dir I -type clk trace_clk
create_bd_pin -dir I -type rst trace_rst

create_bd_cell -type ip -vlnv xilinx.com:ip:emulation_profiler_core:1.0 dpa_hub
set_property -dict {CONFIG.NUM_TRACE_PORTS 7 CONFIG.SLR_ASSIGNMENTS SLR0 CONFIG.S_AXIMM_DATA_WIDTH 64} [get_bd_cells dpa_hub]
create_bd_cell -type ip -vlnv xilinx.com:ip:sim_accel_monitor:1.0 dpa_mon0
set_property -dict [list \
  CONFIG.COUNT_WIDTH 64 \
  CONFIG.ENABLE_TRACE 1 \
  CONFIG.EN_AXI_LITE 1 \
  CONFIG.MONITOR_MODE 1 \
  CONFIG.SLR_ASSIGNMENTS SLR2 \
  CONFIG.TRACE_ID 64 \
] [get_bd_cells dpa_mon0]
create_bd_cell -type ip -vlnv xilinx.com:ip:sim_aximm_perf_mon:1.0 dpa_mon1
set_property -dict [list \
  CONFIG.CAPTURE_BURSTS 0 \
  CONFIG.COUNT_WIDTH 64 \
  CONFIG.ENABLE_COUNTERS true \
  CONFIG.ENABLE_DEBUG true \
  CONFIG.ENABLE_TRACE true \
  CONFIG.EN_AXI_LITE 1 \
  CONFIG.MODE_SDACCEL true \
  CONFIG.MONITOR_ID {wide_vadd_1:m_axi_gmem-DDR[1]} \
  CONFIG.SLR_ASSIGNMENTS SLR2 \
  CONFIG.TRACE_READ_ID 0 \
  CONFIG.TRACE_WRITE_ID 1 \
] [get_bd_cells dpa_mon1]
create_bd_cell -type ip -vlnv xilinx.com:ip:sim_aximm_perf_mon:1.0 dpa_mon2
set_property -dict [list \
  CONFIG.CAPTURE_BURSTS 0 \
  CONFIG.COUNT_WIDTH 64 \
  CONFIG.ENABLE_COUNTERS true \
  CONFIG.ENABLE_DEBUG true \
  CONFIG.ENABLE_TRACE true \
  CONFIG.EN_AXI_LITE 1 \
  CONFIG.MODE_SDACCEL true \
  CONFIG.MONITOR_ID {wide_vadd_1:m_axi_gmem1-DDR[1]} \
  CONFIG.SLR_ASSIGNMENTS SLR2 \
  CONFIG.TRACE_READ_ID 2 \
  CONFIG.TRACE_WRITE_ID 3 \
] [get_bd_cells dpa_mon2]
create_bd_cell -type ip -vlnv xilinx.com:ip:sim_aximm_perf_mon:1.0 dpa_mon3
set_property -dict [list \
  CONFIG.CAPTURE_BURSTS 0 \
  CONFIG.COUNT_WIDTH 64 \
  CONFIG.ENABLE_COUNTERS true \
  CONFIG.ENABLE_DEBUG true \
  CONFIG.ENABLE_TRACE true \
  CONFIG.EN_AXI_LITE 1 \
  CONFIG.MODE_SDACCEL true \
  CONFIG.MONITOR_ID {wide_vadd_1:m_axi_gmem2-DDR[1]} \
  CONFIG.SLR_ASSIGNMENTS SLR2 \
  CONFIG.TRACE_READ_ID 4 \
  CONFIG.TRACE_WRITE_ID 5 \
] [get_bd_cells dpa_mon3]
create_bd_cell -type ip -vlnv xilinx.com:ip:axi_interconnect:2.1 dpa_ctrl_interconnect
set_property -dict [list \
  CONFIG.M00_HAS_REGSLICE 1 \
  CONFIG.M01_HAS_REGSLICE 1 \
  CONFIG.M02_HAS_REGSLICE 1 \
  CONFIG.M03_HAS_REGSLICE 1 \
  CONFIG.M04_HAS_REGSLICE 1 \
  CONFIG.M05_HAS_REGSLICE 1 \
  CONFIG.NUM_MI 6 \
  CONFIG.NUM_SI 1 \
  CONFIG.S00_HAS_REGSLICE 1 \
] [get_bd_cells dpa_ctrl_interconnect]

# ---- connections ----

current_bd_instance /interrupt_concat
connect_bd_net -net In0_1 [get_bd_pins In0] [get_bd_pins xlconcat_interrupt_0/In0]
connect_bd_net [get_bd_pins xlconcat_interrupt_0/dout] [get_bd_pins xlconcat_interrupt/In0]
connect_bd_net [get_bd_pins xlconcat_interrupt_1/dout] [get_bd_pins xlconcat_interrupt/In1]
connect_bd_net [get_bd_pins xlconcat_interrupt_2/dout] [get_bd_pins xlconcat_interrupt/In2]
connect_bd_net [get_bd_pins xlconcat_interrupt_3/dout] [get_bd_pins xlconcat_interrupt/In3]
connect_bd_net [get_bd_pins xlconcat_interrupt/dout] [get_bd_pins xlconcat_interrupt_dout]
connect_bd_net [get_bd_pins xlconstant_gnd/dout] \
  [get_bd_pins xlconcat_interrupt_0/In1] [get_bd_pins xlconcat_interrupt_0/In2] [get_bd_pins xlconcat_interrupt_0/In3] \
  [get_bd_pins xlconcat_interrupt_0/In4] [get_bd_pins xlconcat_interrupt_0/In5] [get_bd_pins xlconcat_interrupt_0/In6] \
  [get_bd_pins xlconcat_interrupt_0/In7] [get_bd_pins xlconcat_interrupt_0/In8] [get_bd_pins xlconcat_interrupt_0/In9] \
  [get_bd_pins xlconcat_interrupt_0/In10] [get_bd_pins xlconcat_interrupt_0/In11] [get_bd_pins xlconcat_interrupt_0/In12] \
  [get_bd_pins xlconcat_interrupt_0/In13] [get_bd_pins xlconcat_interrupt_0/In14] [get_bd_pins xlconcat_interrupt_0/In15] \
  [get_bd_pins xlconcat_interrupt_0/In16] [get_bd_pins xlconcat_interrupt_0/In17] [get_bd_pins xlconcat_interrupt_0/In18] \
  [get_bd_pins xlconcat_interrupt_0/In19] [get_bd_pins xlconcat_interrupt_0/In20] [get_bd_pins xlconcat_interrupt_0/In21] \
  [get_bd_pins xlconcat_interrupt_0/In22] [get_bd_pins xlconcat_interrupt_0/In23] [get_bd_pins xlconcat_interrupt_0/In24] \
  [get_bd_pins xlconcat_interrupt_0/In25] [get_bd_pins xlconcat_interrupt_0/In26] [get_bd_pins xlconcat_interrupt_0/In27] \
  [get_bd_pins xlconcat_interrupt_0/In28] [get_bd_pins xlconcat_interrupt_0/In29] [get_bd_pins xlconcat_interrupt_0/In30] \
  [get_bd_pins xlconcat_interrupt_0/In31] [get_bd_pins xlconcat_interrupt_1/In0] [get_bd_pins xlconcat_interrupt_1/In1] \
  [get_bd_pins xlconcat_interrupt_1/In2] [get_bd_pins xlconcat_interrupt_1/In3] [get_bd_pins xlconcat_interrupt_1/In4] \
  [get_bd_pins xlconcat_interrupt_1/In5] [get_bd_pins xlconcat_interrupt_1/In6] [get_bd_pins xlconcat_interrupt_1/In7] \
  [get_bd_pins xlconcat_interrupt_1/In8] [get_bd_pins xlconcat_interrupt_1/In9] [get_bd_pins xlconcat_interrupt_1/In10] \
  [get_bd_pins xlconcat_interrupt_1/In11] [get_bd_pins xlconcat_interrupt_1/In12] [get_bd_pins xlconcat_interrupt_1/In13] \
  [get_bd_pins xlconcat_interrupt_1/In14] [get_bd_pins xlconcat_interrupt_1/In15] [get_bd_pins xlconcat_interrupt_1/In16] \
  [get_bd_pins xlconcat_interrupt_1/In17] [get_bd_pins xlconcat_interrupt_1/In18] [get_bd_pins xlconcat_interrupt_1/In19] \
  [get_bd_pins xlconcat_interrupt_1/In20] [get_bd_pins xlconcat_interrupt_1/In21] [get_bd_pins xlconcat_interrupt_1/In22] \
  [get_bd_pins xlconcat_interrupt_1/In23] [get_bd_pins xlconcat_interrupt_1/In24] [get_bd_pins xlconcat_interrupt_1/In25] \
  [get_bd_pins xlconcat_interrupt_1/In26] [get_bd_pins xlconcat_interrupt_1/In27] [get_bd_pins xlconcat_interrupt_1/In28] \
  [get_bd_pins xlconcat_interrupt_1/In29] [get_bd_pins xlconcat_interrupt_1/In30] [get_bd_pins xlconcat_interrupt_1/In31] \
  [get_bd_pins xlconcat_interrupt_2/In0] [get_bd_pins xlconcat_interrupt_2/In1] [get_bd_pins xlconcat_interrupt_2/In2] \
  [get_bd_pins xlconcat_interrupt_2/In3] [get_bd_pins xlconcat_interrupt_2/In4] [get_bd_pins xlconcat_interrupt_2/In5] \
  [get_bd_pins xlconcat_interrupt_2/In6] [get_bd_pins xlconcat_interrupt_2/In7] [get_bd_pins xlconcat_interrupt_2/In8] \
  [get_bd_pins xlconcat_interrupt_2/In9] [get_bd_pins xlconcat_interrupt_2/In10] [get_bd_pins xlconcat_interrupt_2/In11] \
  [get_bd_pins xlconcat_interrupt_2/In12] [get_bd_pins xlconcat_interrupt_2/In13] [get_bd_pins xlconcat_interrupt_2/In14] \
  [get_bd_pins xlconcat_interrupt_2/In15] [get_bd_pins xlconcat_interrupt_2/In16] [get_bd_pins xlconcat_interrupt_2/In17] \
  [get_bd_pins xlconcat_interrupt_2/In18] [get_bd_pins xlconcat_interrupt_2/In19] [get_bd_pins xlconcat_interrupt_2/In20] \
  [get_bd_pins xlconcat_interrupt_2/In21] [get_bd_pins xlconcat_interrupt_2/In22] [get_bd_pins xlconcat_interrupt_2/In23] \
  [get_bd_pins xlconcat_interrupt_2/In24] [get_bd_pins xlconcat_interrupt_2/In25] [get_bd_pins xlconcat_interrupt_2/In26] \
  [get_bd_pins xlconcat_interrupt_2/In27] [get_bd_pins xlconcat_interrupt_2/In28] [get_bd_pins xlconcat_interrupt_2/In29] \
  [get_bd_pins xlconcat_interrupt_2/In30] [get_bd_pins xlconcat_interrupt_2/In31] [get_bd_pins xlconcat_interrupt_3/In0] \
  [get_bd_pins xlconcat_interrupt_3/In1] [get_bd_pins xlconcat_interrupt_3/In2] [get_bd_pins xlconcat_interrupt_3/In3] \
  [get_bd_pins xlconcat_interrupt_3/In4] [get_bd_pins xlconcat_interrupt_3/In5] [get_bd_pins xlconcat_interrupt_3/In6] \
  [get_bd_pins xlconcat_interrupt_3/In7] [get_bd_pins xlconcat_interrupt_3/In8] [get_bd_pins xlconcat_interrupt_3/In9] \
  [get_bd_pins xlconcat_interrupt_3/In10] [get_bd_pins xlconcat_interrupt_3/In11] [get_bd_pins xlconcat_interrupt_3/In12] \
  [get_bd_pins xlconcat_interrupt_3/In13] [get_bd_pins xlconcat_interrupt_3/In14] [get_bd_pins xlconcat_interrupt_3/In15] \
  [get_bd_pins xlconcat_interrupt_3/In16] [get_bd_pins xlconcat_interrupt_3/In17] [get_bd_pins xlconcat_interrupt_3/In18] \
  [get_bd_pins xlconcat_interrupt_3/In19] [get_bd_pins xlconcat_interrupt_3/In20] [get_bd_pins xlconcat_interrupt_3/In21] \
  [get_bd_pins xlconcat_interrupt_3/In22] [get_bd_pins xlconcat_interrupt_3/In23] [get_bd_pins xlconcat_interrupt_3/In24] \
  [get_bd_pins xlconcat_interrupt_3/In25] [get_bd_pins xlconcat_interrupt_3/In26] [get_bd_pins xlconcat_interrupt_3/In27] \
  [get_bd_pins xlconcat_interrupt_3/In28] [get_bd_pins xlconcat_interrupt_3/In29] [get_bd_pins xlconcat_interrupt_3/In30] \
  [get_bd_pins xlconcat_interrupt_3/In31]

current_bd_instance /slr0
connect_bd_intf_net -intf_net interconnect_axilite_0_M00_AXI [get_bd_intf_pins interconnect_axilite_user_0/M00_AXI] [get_bd_intf_pins to_delete_kernel_ctrl_0/S_AXI]
connect_bd_intf_net -intf_net xtlm_simple_intercon_0_ICN_S_AXI_0_AXI [get_bd_intf_pins S00_AXI] [get_bd_intf_pins icn_pass_0/S00_AXI]
connect_bd_intf_net -intf_net xtlm_simple_intercon_0_ICN_M_AXI_0_AXI [get_bd_intf_pins M00_AXI] [get_bd_intf_pins icn_pass_0/M00_AXI]
connect_bd_intf_net [get_bd_intf_pins S00_AXI1] [get_bd_intf_pins interconnect_axilite_user_0/S00_AXI]
connect_bd_net -net ui_clk_clk [get_bd_pins ddr_default_clk_0] [get_bd_pins icn_pass_0/m00_axi_aclk] [get_bd_pins icn_pass_0/s00_axi_aclk]
connect_bd_net -net ui_clk_sync_rst [get_bd_pins ddr_default_rst_0] [get_bd_pins icn_pass_0/m00_axi_aresetn] [get_bd_pins icn_pass_0/s00_axi_aresetn]
connect_bd_net -net slowest_sync_clk_0_1 [get_bd_pins slowest_sync_clk] [get_bd_pins psr_kernel_clk_0/slowest_sync_clk]
connect_bd_net -net ext_reset_in_0_1 [get_bd_pins ext_reset_in] [get_bd_pins psr_kernel_clk_0/ext_reset_in]
connect_bd_net -net slowest_sync_clk_2_1 [get_bd_pins slowest_sync_clk1] [get_bd_pins psr_kernel2_clk_0/slowest_sync_clk]
connect_bd_net -net ext_reset_in_2_1 [get_bd_pins ext_reset_in1] [get_bd_pins psr_kernel2_clk_0/ext_reset_in]
connect_bd_net -net slowest_sync_clk_1_1 [get_bd_pins dma_pcie_aclk] \
  [get_bd_pins to_delete_kernel_ctrl_0/s_axi_aclk] [get_bd_pins interconnect_axilite_user_0/ACLK] \
  [get_bd_pins interconnect_axilite_user_0/S00_ACLK] [get_bd_pins interconnect_axilite_user_0/M00_ACLK]
connect_bd_net -net ext_reset_in_1_1 [get_bd_pins dma_pcie_arst] \
  [get_bd_pins to_delete_kernel_ctrl_0/s_axi_aresetn] [get_bd_pins interconnect_axilite_user_0/ARESETN] \
  [get_bd_pins interconnect_axilite_user_0/S00_ARESETN] [get_bd_pins interconnect_axilite_user_0/M00_ARESETN]

current_bd_instance /slr1
connect_bd_intf_net -intf_net interconnect_axilite_1_M00_AXI [get_bd_intf_pins interconnect_axilite_user_1/M00_AXI] [get_bd_intf_pins to_delete_kernel_ctrl_1/S_AXI]
connect_bd_intf_net [get_bd_intf_pins S00_AXI2] [get_bd_intf_pins interconnect_axilite_user_1/S00_AXI]
connect_bd_intf_net -intf_net xtlm_simple_intercon_0_ICN_M_AXI_2_AXI [get_bd_intf_pins M00_AXI1] [get_bd_intf_pins icn_pass_2/M00_AXI]
connect_bd_intf_net -intf_net xtlm_simple_intercon_0_ICN_S_AXI_1_AXI [get_bd_intf_pins S00_AXI] [get_bd_intf_pins icn_pass_1/S00_AXI]
connect_bd_intf_net -intf_net xtlm_simple_intercon_0_ICN_M_AXI_1_AXI [get_bd_intf_pins M00_AXI] [get_bd_intf_pins icn_pass_1/M00_AXI]
connect_bd_intf_net -intf_net xtlm_simple_intercon_0_ICN_S_AXI_2_AXI [get_bd_intf_pins S00_AXI1] [get_bd_intf_pins icn_pass_2/S00_AXI]
connect_bd_net -net ui_clk_clk [get_bd_pins ddr_default_clk_0] \
  [get_bd_pins icn_pass_1/m00_axi_aclk] [get_bd_pins icn_pass_2/m00_axi_aclk] [get_bd_pins icn_pass_2/s00_axi_aclk] \
  [get_bd_pins icn_pass_1/s00_axi_aclk]
connect_bd_net -net ui_clk_sync_rst [get_bd_pins ddr_default_rst_0] \
  [get_bd_pins icn_pass_1/m00_axi_aresetn] [get_bd_pins icn_pass_2/m00_axi_aresetn] [get_bd_pins icn_pass_2/s00_axi_aresetn] \
  [get_bd_pins icn_pass_1/s00_axi_aresetn]
connect_bd_net -net slowest_sync_clk_0_1 [get_bd_pins slowest_sync_clk] [get_bd_pins psr_kernel_clk_1/slowest_sync_clk]
connect_bd_net -net ext_reset_in_0_1 [get_bd_pins ext_reset_in] [get_bd_pins psr_kernel_clk_1/ext_reset_in]
connect_bd_net -net slowest_sync_clk_2_1 [get_bd_pins slowest_sync_clk1] [get_bd_pins psr_kernel2_clk_1/slowest_sync_clk]
connect_bd_net -net ext_reset_in_2_1 [get_bd_pins ext_reset_in1] [get_bd_pins psr_kernel2_clk_1/ext_reset_in]
connect_bd_net -net slowest_sync_clk_1_1 [get_bd_pins dma_pcie_aclk] \
  [get_bd_pins to_delete_kernel_ctrl_1/s_axi_aclk] [get_bd_pins interconnect_axilite_user_1/ACLK] \
  [get_bd_pins interconnect_axilite_user_1/S00_ACLK] [get_bd_pins interconnect_axilite_user_1/M00_ACLK]
connect_bd_net -net ext_reset_in_1_1 [get_bd_pins dma_pcie_arst] \
  [get_bd_pins to_delete_kernel_ctrl_1/s_axi_aresetn] [get_bd_pins interconnect_axilite_user_1/ARESETN] \
  [get_bd_pins interconnect_axilite_user_1/S00_ARESETN] [get_bd_pins interconnect_axilite_user_1/M00_ARESETN]

current_bd_instance /slr2
connect_bd_intf_net [get_bd_intf_pins S00_AXI1] [get_bd_intf_pins interconnect_axilite_user_2/S00_AXI]
connect_bd_intf_net -intf_net xtlm_simple_intercon_0_ICN_S_AXI_3_AXI [get_bd_intf_pins S00_AXI] [get_bd_intf_pins icn_pass_3/S00_AXI]
connect_bd_intf_net -intf_net xtlm_simple_intercon_0_ICN_M_AXI_3_AXI [get_bd_intf_pins M00_AXI] [get_bd_intf_pins icn_pass_3/M00_AXI]
connect_bd_intf_net -intf_net interconnect_axilite_2_M00_AXI [get_bd_intf_pins M00_AXI1] [get_bd_intf_pins interconnect_axilite_user_2/M00_AXI]
connect_bd_intf_net [get_bd_intf_pins M01_AXI] [get_bd_intf_pins interconnect_axilite_user_2/M01_AXI]
connect_bd_net -net ui_clk_clk [get_bd_pins ddr_default_clk_0] [get_bd_pins icn_pass_3/m00_axi_aclk] [get_bd_pins icn_pass_3/s00_axi_aclk]
connect_bd_net -net ui_clk_sync_rst [get_bd_pins ddr_default_rst_0] [get_bd_pins icn_pass_3/m00_axi_aresetn] [get_bd_pins icn_pass_3/s00_axi_aresetn]
connect_bd_net -net slowest_sync_clk_0_1 [get_bd_pins slowest_sync_clk] \
  [get_bd_pins psr_kernel_clk_2/slowest_sync_clk] [get_bd_pins interconnect_axilite_user_2/M01_ACLK]
connect_bd_net -net ext_reset_in_0_1 [get_bd_pins ext_reset_in] [get_bd_pins psr_kernel_clk_2/ext_reset_in]
connect_bd_net -net slowest_sync_clk_2_1 [get_bd_pins slowest_sync_clk1] [get_bd_pins psr_kernel2_clk_2/slowest_sync_clk]
connect_bd_net -net ext_reset_in_2_1 [get_bd_pins ext_reset_in1] [get_bd_pins psr_kernel2_clk_2/ext_reset_in]
connect_bd_net -net slowest_sync_clk_1_1 [get_bd_pins dma_pcie_aclk] \
  [get_bd_pins interconnect_axilite_user_2/ACLK] [get_bd_pins interconnect_axilite_user_2/S00_ACLK] \
  [get_bd_pins interconnect_axilite_user_2/M00_ACLK]
connect_bd_net -net ext_reset_in_1_1 [get_bd_pins dma_pcie_arst] \
  [get_bd_pins interconnect_axilite_user_2/ARESETN] [get_bd_pins interconnect_axilite_user_2/S00_ARESETN] \
  [get_bd_pins interconnect_axilite_user_2/M00_ARESETN]
connect_bd_net [get_bd_pins psr_kernel_clk_2/interconnect_aresetn] [get_bd_pins interconnect_axilite_user_2/M01_ARESETN]
connect_bd_net [get_bd_pins psr_kernel_clk_2/peripheral_aresetn] [get_bd_pins peripheral_aresetn]

current_bd_instance /System_DPA
connect_bd_intf_net [get_bd_intf_pins dpa_mon2/S_AXI] [get_bd_intf_pins dpa_ctrl_interconnect/M04_AXI]
connect_bd_intf_net -intf_net wide_vadd_1_m_axi_gmem1 [get_bd_intf_pins MON_M_AXI1] [get_bd_intf_pins dpa_mon2/MON_M_AXI]
connect_bd_intf_net -intf_net wide_vadd_1_m_axi_gmem2 [get_bd_intf_pins MON_M_AXI2] [get_bd_intf_pins dpa_mon3/MON_M_AXI]
connect_bd_intf_net [get_bd_intf_pins dpa_mon0/TRACE_OUT] [get_bd_intf_pins dpa_hub/TRACE_IN_0]
connect_bd_intf_net [get_bd_intf_pins dpa_mon1/TRACE_OUT_0] [get_bd_intf_pins dpa_hub/TRACE_IN_1]
connect_bd_intf_net [get_bd_intf_pins dpa_mon1/TRACE_OUT_1] [get_bd_intf_pins dpa_hub/TRACE_IN_2]
connect_bd_intf_net [get_bd_intf_pins dpa_mon2/TRACE_OUT_0] [get_bd_intf_pins dpa_hub/TRACE_IN_3]
connect_bd_intf_net [get_bd_intf_pins dpa_mon2/TRACE_OUT_1] [get_bd_intf_pins dpa_hub/TRACE_IN_4]
connect_bd_intf_net [get_bd_intf_pins dpa_mon3/TRACE_OUT_0] [get_bd_intf_pins dpa_hub/TRACE_IN_5]
connect_bd_intf_net [get_bd_intf_pins dpa_mon3/TRACE_OUT_1] [get_bd_intf_pins dpa_hub/TRACE_IN_6]
connect_bd_intf_net [get_bd_intf_pins S00_AXI] [get_bd_intf_pins dpa_ctrl_interconnect/S00_AXI]
connect_bd_intf_net -intf_net xtlm_simple_intercon_0_M04_AXI [get_bd_intf_pins S_AXIMM] [get_bd_intf_pins dpa_hub/S_AXIMM]
connect_bd_intf_net -intf_net slr2_M01_AXI [get_bd_intf_pins MON_S_AXI] [get_bd_intf_pins dpa_mon1/MON_S_AXI]
connect_bd_intf_net [get_bd_intf_pins MON_S_AXI] [get_bd_intf_pins dpa_mon2/MON_S_AXI]
connect_bd_intf_net [get_bd_intf_pins MON_S_AXI] [get_bd_intf_pins dpa_mon3/MON_S_AXI]
connect_bd_intf_net [get_bd_intf_pins MON_S_AXI] [get_bd_intf_pins dpa_mon0/S_AXI_MON]
connect_bd_intf_net -intf_net wide_vadd_1_m_axi_gmem [get_bd_intf_pins MON_M_AXI] [get_bd_intf_pins dpa_mon1/MON_M_AXI]
connect_bd_intf_net [get_bd_intf_pins dpa_hub/S_AXIFIFO] [get_bd_intf_pins dpa_ctrl_interconnect/M00_AXI]
connect_bd_intf_net [get_bd_intf_pins dpa_hub/S_AXIHUB] [get_bd_intf_pins dpa_ctrl_interconnect/M01_AXI]
connect_bd_intf_net [get_bd_intf_pins dpa_mon0/S_AXI] [get_bd_intf_pins dpa_ctrl_interconnect/M02_AXI]
connect_bd_intf_net [get_bd_intf_pins dpa_mon1/S_AXI] [get_bd_intf_pins dpa_ctrl_interconnect/M03_AXI]
connect_bd_intf_net [get_bd_intf_pins dpa_mon3/S_AXI] [get_bd_intf_pins dpa_ctrl_interconnect/M05_AXI]
connect_bd_net -net slowest_sync_clk_1_1 [get_bd_pins dma_pcie_aclk] \
  [get_bd_pins dpa_hub/s_aximm_clk] [get_bd_pins dpa_ctrl_interconnect/ACLK] [get_bd_pins dpa_ctrl_interconnect/S00_ACLK]
connect_bd_net -net ext_reset_in_1_1 [get_bd_pins dma_pcie_arst] \
  [get_bd_pins dpa_hub/s_aximm_aresetn] [get_bd_pins dpa_ctrl_interconnect/ARESETN] \
  [get_bd_pins dpa_ctrl_interconnect/S00_ARESETN]
connect_bd_net -net slowest_sync_clk_0_1 [get_bd_pins trace_clk] \
  [get_bd_pins dpa_mon0/trace_clk] [get_bd_pins dpa_mon0/mon_clk] [get_bd_pins dpa_mon1/mon_clk] \
  [get_bd_pins dpa_mon1/trace_clk] [get_bd_pins dpa_mon2/mon_clk] [get_bd_pins dpa_mon2/trace_clk] \
  [get_bd_pins dpa_mon3/mon_clk] [get_bd_pins dpa_mon3/trace_clk] [get_bd_pins dpa_hub/trace_clk] \
  [get_bd_pins dpa_hub/axilite_clk] [get_bd_pins dpa_ctrl_interconnect/M00_ACLK] [get_bd_pins dpa_ctrl_interconnect/M01_ACLK] \
  [get_bd_pins dpa_ctrl_interconnect/M02_ACLK] [get_bd_pins dpa_ctrl_interconnect/M03_ACLK] \
  [get_bd_pins dpa_ctrl_interconnect/M04_ACLK] [get_bd_pins dpa_ctrl_interconnect/M05_ACLK]
connect_bd_net -net slr2_peripheral_aresetn [get_bd_pins trace_rst] \
  [get_bd_pins dpa_mon0/trace_rst] [get_bd_pins dpa_mon0/mon_resetn] [get_bd_pins dpa_mon1/mon_resetn] \
  [get_bd_pins dpa_mon1/trace_rst] [get_bd_pins dpa_mon2/mon_resetn] [get_bd_pins dpa_mon2/trace_rst] \
  [get_bd_pins dpa_mon3/mon_resetn] [get_bd_pins dpa_mon3/trace_rst] [get_bd_pins dpa_hub/trace_aresetn] \
  [get_bd_pins dpa_hub/axilite_aresetn] [get_bd_pins dpa_ctrl_interconnect/M00_ARESETN] \
  [get_bd_pins dpa_ctrl_interconnect/M01_ARESETN] [get_bd_pins dpa_ctrl_interconnect/M02_ARESETN] \
  [get_bd_pins dpa_ctrl_interconnect/M03_ARESETN] [get_bd_pins dpa_ctrl_interconnect/M04_ARESETN] \
  [get_bd_pins dpa_ctrl_interconnect/M05_ARESETN]
set_property HDL_ATTRIBUTE.DPA_IP true [get_bd_cells dpa_hub]
set_property HDL_ATTRIBUTE.DPA_IP_FULLNAME dpa_hub [get_bd_cells dpa_hub]
set_property HDL_ATTRIBUTE.DPA_IP_PROPERTIES 0 [get_bd_cells dpa_hub]
set_property HDL_ATTRIBUTE.DPA_IP true [get_bd_cells dpa_mon0]
set_property HDL_ATTRIBUTE.DPA_IP_FULLNAME /wide_vadd_1 [get_bd_cells dpa_mon0]
set_property HDL_ATTRIBUTE.DPA_IP_PROPERTIES 11 [get_bd_cells dpa_mon0]
set_property HDL_ATTRIBUTE.DPA_IP true [get_bd_cells dpa_mon1]
set_property HDL_ATTRIBUTE.DPA_IP_FULLNAME {/wide_vadd_1/m_axi_gmem-DDR[1]} [get_bd_cells dpa_mon1]
set_property HDL_ATTRIBUTE.DPA_IP_PROPERTIES 11 [get_bd_cells dpa_mon1]
set_property HDL_ATTRIBUTE.DPA_IP true [get_bd_cells dpa_mon2]
set_property HDL_ATTRIBUTE.DPA_IP_FULLNAME {/wide_vadd_1/m_axi_gmem1-DDR[1]} [get_bd_cells dpa_mon2]
set_property HDL_ATTRIBUTE.DPA_IP_PROPERTIES 11 [get_bd_cells dpa_mon2]
set_property HDL_ATTRIBUTE.DPA_IP true [get_bd_cells dpa_mon3]
set_property HDL_ATTRIBUTE.DPA_IP_FULLNAME {/wide_vadd_1/m_axi_gmem2-DDR[1]} [get_bd_cells dpa_mon3]
set_property HDL_ATTRIBUTE.DPA_IP_PROPERTIES 11 [get_bd_cells dpa_mon3]

current_bd_instance /
connect_bd_intf_net [get_bd_intf_pins wide_vadd_1/m_axi_gmem2] [get_bd_intf_pins memory_subsystem/S06_AXI]
connect_bd_intf_net [get_bd_intf_pins wide_vadd_1/m_axi_gmem2] [get_bd_intf_pins System_DPA/MON_M_AXI2]
connect_bd_intf_net [get_bd_intf_pins wide_vadd_1/m_axi_gmem1] [get_bd_intf_pins memory_subsystem/S05_AXI]
connect_bd_intf_net [get_bd_intf_pins wide_vadd_1/m_axi_gmem1] [get_bd_intf_pins System_DPA/MON_M_AXI1]
connect_bd_intf_net [get_bd_intf_pins slr2/S00_AXI1] [get_bd_intf_pins user_slr_icn/M02_AXI]
connect_bd_intf_net -intf_net xtlm_simple_intercon_0_ICN_S_AXI_0_AXI [get_bd_intf_pins slr0/S00_AXI] [get_bd_intf_pins xtlm_simple_intercon_0/M00_AXI]
connect_bd_intf_net -intf_net xtlm_simple_intercon_0_ICN_M_AXI_0_AXI [get_bd_intf_pins memory_subsystem/S00_AXI] [get_bd_intf_pins slr0/M00_AXI]
connect_bd_intf_net [get_bd_intf_pins memory_subsystem/M00_AXI] [get_bd_intf_pins sim_ddr_0/C0_DDR_SAXI]
connect_bd_intf_net -intf_net xtlm_simple_intercon_0_ICN_S_AXI_1_AXI [get_bd_intf_pins slr1/S00_AXI] [get_bd_intf_pins xtlm_simple_intercon_0/M01_AXI]
connect_bd_intf_net [get_bd_intf_ports C0_DDR_MAXI_0] [get_bd_intf_pins memory_subsystem/M01_AXI]
connect_bd_intf_net -intf_net xtlm_simple_intercon_0_ICN_M_AXI_1_AXI [get_bd_intf_pins memory_subsystem/S01_AXI] [get_bd_intf_pins slr1/M00_AXI]
connect_bd_intf_net -intf_net xtlm_simple_intercon_0_ICN_S_AXI_2_AXI [get_bd_intf_pins slr1/S00_AXI1] [get_bd_intf_pins xtlm_simple_intercon_0/M02_AXI]
connect_bd_intf_net -intf_net xtlm_simple_intercon_0_ICN_M_AXI_2_AXI [get_bd_intf_pins memory_subsystem/S02_AXI] [get_bd_intf_pins slr1/M00_AXI1]
connect_bd_intf_net [get_bd_intf_pins memory_subsystem/M02_AXI] [get_bd_intf_pins sim_ddr_2/C0_DDR_SAXI]
connect_bd_intf_net -intf_net xtlm_simple_intercon_0_ICN_S_AXI_3_AXI [get_bd_intf_pins slr2/S00_AXI] [get_bd_intf_pins xtlm_simple_intercon_0/M03_AXI]
connect_bd_intf_net -intf_net xtlm_simple_intercon_0_ICN_M_AXI_3_AXI [get_bd_intf_pins memory_subsystem/S03_AXI] [get_bd_intf_pins slr2/M00_AXI]
connect_bd_intf_net [get_bd_intf_pins memory_subsystem/M03_AXI] [get_bd_intf_pins sim_ddr_3/C0_DDR_SAXI]
connect_bd_intf_net [get_bd_intf_pins slr0/S00_AXI1] [get_bd_intf_pins user_slr_icn/M00_AXI]
connect_bd_intf_net -intf_net static_region_data_M_AXI_4 [get_bd_intf_ports data_M_AXI_4] [get_bd_intf_pins xtlm_simple_intercon_0/S04_AXI]
connect_bd_intf_net -intf_net static_region_data_M_AXI_0 [get_bd_intf_ports data_M_AXI_0] [get_bd_intf_pins xtlm_simple_intercon_0/S00_AXI]
connect_bd_intf_net -intf_net static_region_data_M_AXI_3 [get_bd_intf_ports data_M_AXI_3] [get_bd_intf_pins xtlm_simple_intercon_0/S03_AXI]
connect_bd_intf_net -intf_net static_region_data_M_AXI_1 [get_bd_intf_ports data_M_AXI_1] [get_bd_intf_pins xtlm_simple_intercon_0/S01_AXI]
connect_bd_intf_net [get_bd_intf_pins slr1/S00_AXI2] [get_bd_intf_pins user_slr_icn/M01_AXI]
connect_bd_intf_net -intf_net user_slr_icn_slave [get_bd_intf_ports userpf_control_M_AXI] [get_bd_intf_pins user_slr_icn/S00_AXI]
connect_bd_intf_net -intf_net static_region_data_M_AXI_2 [get_bd_intf_ports data_M_AXI_2] [get_bd_intf_pins xtlm_simple_intercon_0/S02_AXI]
connect_bd_intf_net [get_bd_intf_pins wide_vadd_1/m_axi_gmem] [get_bd_intf_pins memory_subsystem/S04_AXI]
connect_bd_intf_net [get_bd_intf_pins wide_vadd_1/m_axi_gmem] [get_bd_intf_pins System_DPA/MON_M_AXI]
connect_bd_intf_net [get_bd_intf_pins wide_vadd_1/s_axi_control] [get_bd_intf_pins slr2/M01_AXI]
connect_bd_intf_net [get_bd_intf_pins wide_vadd_1/s_axi_control] [get_bd_intf_pins System_DPA/MON_S_AXI]
connect_bd_intf_net [get_bd_intf_pins xtlm_simple_intercon_0/M04_AXI] [get_bd_intf_pins System_DPA/S_AXIMM]
connect_bd_intf_net [get_bd_intf_pins System_DPA/S00_AXI] [get_bd_intf_pins slr2/M00_AXI1]
connect_bd_net -net irq_cu_1 [get_bd_pins interrupt_concat/xlconcat_interrupt_dout] [get_bd_ports irq_cu]
connect_bd_net -net ext_reset_in_0_1 [get_bd_pins kernel_clk/sync_rst] \
  [get_bd_pins slr0/ext_reset_in] [get_bd_pins slr1/ext_reset_in] [get_bd_pins slr2/ext_reset_in]
connect_bd_net -net ext_reset_in_1_1 [get_bd_ports dma_pcie_arst] \
  [get_bd_pins xtlm_simple_intercon_0/s00_axi_aresetn] [get_bd_pins xtlm_simple_intercon_0/s01_axi_aresetn] \
  [get_bd_pins xtlm_simple_intercon_0/s02_axi_aresetn] [get_bd_pins xtlm_simple_intercon_0/s03_axi_aresetn] \
  [get_bd_pins xtlm_simple_intercon_0/s04_axi_aresetn] [get_bd_pins slr0/dma_pcie_arst] [get_bd_pins slr1/dma_pcie_arst] \
  [get_bd_pins slr2/dma_pcie_arst] [get_bd_pins xtlm_simple_intercon_0/m04_axi_aresetn] \
  [get_bd_pins System_DPA/dma_pcie_arst] [get_bd_pins user_slr_icn/ARESETN] [get_bd_pins user_slr_icn/S00_ARESETN] \
  [get_bd_pins user_slr_icn/M00_ARESETN] [get_bd_pins user_slr_icn/M01_ARESETN] [get_bd_pins user_slr_icn/M02_ARESETN]
connect_bd_net -net ext_reset_in_2_1 [get_bd_pins kernel2_clk/sync_rst] \
  [get_bd_pins slr0/ext_reset_in1] [get_bd_pins slr1/ext_reset_in1] [get_bd_pins slr2/ext_reset_in1]
connect_bd_net -net slowest_sync_clk_0_1 [get_bd_pins kernel_clk/clk] \
  [get_bd_pins slr0/slowest_sync_clk] [get_bd_pins slr1/slowest_sync_clk] [get_bd_pins slr2/slowest_sync_clk] \
  [get_bd_pins wide_vadd_1/ap_clk] [get_bd_pins memory_subsystem/aclk1] [get_bd_pins System_DPA/trace_clk]
connect_bd_net -net slowest_sync_clk_1_1 [get_bd_ports dma_pcie_aclk] \
  [get_bd_pins xtlm_simple_intercon_0/s00_axi_aclk] [get_bd_pins xtlm_simple_intercon_0/s01_axi_aclk] \
  [get_bd_pins xtlm_simple_intercon_0/s02_axi_aclk] [get_bd_pins xtlm_simple_intercon_0/s03_axi_aclk] \
  [get_bd_pins xtlm_simple_intercon_0/s04_axi_aclk] [get_bd_pins slr0/dma_pcie_aclk] [get_bd_pins slr1/dma_pcie_aclk] \
  [get_bd_pins slr2/dma_pcie_aclk] [get_bd_pins xtlm_simple_intercon_0/m04_axi_aclk] [get_bd_pins System_DPA/dma_pcie_aclk] \
  [get_bd_pins user_slr_icn/ACLK] [get_bd_pins user_slr_icn/S00_ACLK] [get_bd_pins user_slr_icn/M00_ACLK] \
  [get_bd_pins user_slr_icn/M01_ACLK] [get_bd_pins user_slr_icn/M02_ACLK]
connect_bd_net -net slowest_sync_clk_2_1 [get_bd_pins kernel2_clk/clk] \
  [get_bd_pins slr0/slowest_sync_clk1] [get_bd_pins slr1/slowest_sync_clk1] [get_bd_pins slr2/slowest_sync_clk1]
connect_bd_net -net ui_clk_clk [get_bd_ports ddr_default_clk_0] \
  [get_bd_pins memory_subsystem/aclk] [get_bd_pins xtlm_simple_intercon_0/m00_axi_aclk] \
  [get_bd_pins xtlm_simple_intercon_0/m01_axi_aclk] [get_bd_pins xtlm_simple_intercon_0/m02_axi_aclk] \
  [get_bd_pins xtlm_simple_intercon_0/m03_axi_aclk] [get_bd_pins sim_ddr_0/c0_ddr_saxi_aclk] \
  [get_bd_pins sim_ddr_0/c0_ui_clk] [get_bd_pins sim_ddr_0/s_xdma_axi_aclk] [get_bd_pins sim_ddr_2/c0_ddr_saxi_aclk] \
  [get_bd_pins sim_ddr_2/c0_ui_clk] [get_bd_pins sim_ddr_2/s_xdma_axi_aclk] [get_bd_pins sim_ddr_3/c0_ddr_saxi_aclk] \
  [get_bd_pins sim_ddr_3/c0_ui_clk] [get_bd_pins sim_ddr_3/s_xdma_axi_aclk] [get_bd_pins slr0/ddr_default_clk_0] \
  [get_bd_pins slr1/ddr_default_clk_0] [get_bd_pins slr2/ddr_default_clk_0]
connect_bd_net -net ui_clk_sync_rst [get_bd_ports ddr_default_rst_0] \
  [get_bd_pins memory_subsystem/aresetn] [get_bd_pins xtlm_simple_intercon_0/m00_axi_aresetn] \
  [get_bd_pins xtlm_simple_intercon_0/m01_axi_aresetn] [get_bd_pins xtlm_simple_intercon_0/m02_axi_aresetn] \
  [get_bd_pins xtlm_simple_intercon_0/m03_axi_aresetn] [get_bd_pins sim_ddr_0/c0_ddr_saxi_aresetn] \
  [get_bd_pins sim_ddr_0/s_xdma_axi_aresetn] [get_bd_pins sim_ddr_2/c0_ddr_saxi_aresetn] \
  [get_bd_pins sim_ddr_2/s_xdma_axi_aresetn] [get_bd_pins sim_ddr_3/c0_ddr_saxi_aresetn] \
  [get_bd_pins sim_ddr_3/s_xdma_axi_aresetn] [get_bd_pins slr0/ddr_default_rst_0] [get_bd_pins slr1/ddr_default_rst_0] \
  [get_bd_pins slr2/ddr_default_rst_0]
connect_bd_net [get_bd_pins slr2/peripheral_aresetn] [get_bd_pins wide_vadd_1/ap_rst_n] [get_bd_pins System_DPA/trace_rst]
connect_bd_net [get_bd_pins wide_vadd_1/interrupt] [get_bd_pins interrupt_concat/In0]
set_property HDL_ATTRIBUTE.DPA_TRACE_SLAVE true [get_bd_cells memory_subsystem]
